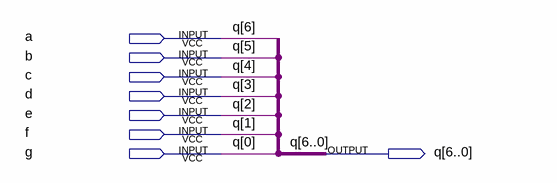
[diagram p0: schematic sheet]
// Quartus schematic juntar.bdf as structural Verilog: 0 symbols, 8 pins
module juntar (
  input  a,
  input  b,
  input  c,
  input  d,
  input  e,
  input  f,
  input  g,
  output [6:0] q
);


  assign q = {a, b, c, d, e, f, g};
endmodule
